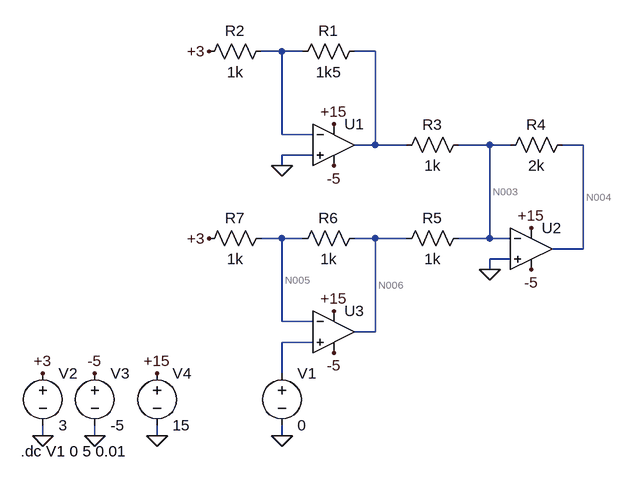
[diagram p0: schematic Draft2.asc]
Draft2.asc, the LTspice schematic file:
Version 4
SHEET 1 880 680
WIRE 80 -144 48 -144
WIRE 112 -144 80 -144
WIRE 224 -144 192 -144
WIRE 80 -16 80 -144
WIRE 128 -16 80 -16
WIRE 224 0 224 -144
WIRE 224 0 192 0
WIRE 272 0 224 0
WIRE 400 0 352 0
WIRE 432 0 400 0
WIRE 544 0 512 0
WIRE 128 16 80 16
WIRE 80 32 80 16
WIRE 80 144 48 144
WIRE 112 144 80 144
WIRE 224 144 192 144
WIRE 272 144 224 144
WIRE 400 144 400 0
WIRE 400 144 352 144
WIRE 432 144 400 144
WIRE 544 160 544 0
WIRE 544 160 496 160
WIRE 432 176 400 176
WIRE 400 192 400 176
WIRE 80 272 80 144
WIRE 128 272 80 272
WIRE 224 288 224 144
WIRE 224 288 192 288
WIRE 128 304 80 304
WIRE 80 352 80 304
WIRE -288 448 -288 432
WIRE -208 448 -208 432
WIRE -112 448 -112 432
WIRE 80 448 80 432
FLAG 160 -32 +15
FLAG 160 32 -5
FLAG 464 128 +15
FLAG 464 192 -5
FLAG 160 256 +15
FLAG 160 320 -5
FLAG -32 -144 +3
FLAG 80 32 0
FLAG 400 192 0
FLAG 80 448 0
FLAG -32 144 +3
FLAG -288 352 +3
FLAG -208 352 -5
FLAG -112 352 +15
FLAG -288 448 0
FLAG -208 448 0
FLAG -112 448 0
SYMBOL OpAmps\\UniversalOpAmp2 160 0 R0
SYMATTR InstName U1
SYMBOL OpAmps\\UniversalOpAmp2 464 160 R0
SYMATTR InstName U2
SYMBOL OpAmps\\UniversalOpAmp2 160 288 R0
SYMATTR InstName U3
SYMBOL res 208 -160 R90
WINDOW 0 0 56 VBottom 2
WINDOW 3 32 56 VTop 2
SYMATTR InstName R1
SYMATTR Value 1k5
SYMBOL res 64 -160 R90
WINDOW 0 0 56 VBottom 2
WINDOW 3 32 56 VTop 2
SYMATTR InstName R2
SYMATTR Value 1k
SYMBOL res 368 -16 R90
WINDOW 0 0 56 VBottom 2
WINDOW 3 32 56 VTop 2
SYMATTR InstName R3
SYMATTR Value 1k
SYMBOL res 528 -16 R90
WINDOW 0 0 56 VBottom 2
WINDOW 3 32 56 VTop 2
SYMATTR InstName R4
SYMATTR Value 2k
SYMBOL res 368 128 R90
WINDOW 0 0 56 VBottom 2
WINDOW 3 32 56 VTop 2
SYMATTR InstName R5
SYMATTR Value 1k
SYMBOL res 208 128 R90
WINDOW 0 0 56 VBottom 2
WINDOW 3 32 56 VTop 2
SYMATTR InstName R6
SYMATTR Value 1k
SYMBOL res 64 128 R90
WINDOW 0 0 56 VBottom 2
WINDOW 3 32 56 VTop 2
SYMATTR InstName R7
SYMATTR Value 1k
SYMBOL voltage 80 336 R0
WINDOW 123 0 0 Left 0
WINDOW 39 0 0 Left 0
SYMATTR InstName V1
SYMATTR Value 0
SYMBOL voltage -288 336 R0
WINDOW 123 0 0 Left 0
WINDOW 39 0 0 Left 0
SYMATTR InstName V2
SYMATTR Value 3
SYMBOL voltage -208 336 R0
WINDOW 123 0 0 Left 0
WINDOW 39 0 0 Left 0
SYMATTR InstName V3
SYMATTR Value -5
SYMBOL voltage -112 336 R0
WINDOW 123 0 0 Left 0
WINDOW 39 0 0 Left 0
SYMATTR InstName V4
SYMATTR Value 15
TEXT -322 472 Left 2 !.dc V1 0 5 0.01

The netlist it stands for:
* Draft2.asc
XU1 0 N001 +15 -5 N002 level2 Avol=1Meg GBW=10Meg Slew=10Meg Ilimit=25m Rail=0 Vos=0 En=0 Enk=0 In=0 Ink=0 Rin=500Meg  ; pins In+ In- V+ V- OUT
XU2 0 N003 +15 -5 N004 level2 Avol=1Meg GBW=10Meg Slew=10Meg Ilimit=25m Rail=0 Vos=0 En=0 Enk=0 In=0 Ink=0 Rin=500Meg  ; pins In+ In- V+ V- OUT
XU3 N007 N005 +15 -5 N006 level2 Avol=1Meg GBW=10Meg Slew=10Meg Ilimit=25m Rail=0 Vos=0 En=0 Enk=0 In=0 Ink=0 Rin=500Meg  ; pins In+ In- V+ V- OUT
R1 N002 N001 1k5
R2 N001 +3 1k
R3 N003 N002 1k
R4 N004 N003 2k
R5 N003 N006 1k
R6 N006 N005 1k
R7 N005 +3 1k
V1 N007 0 0
V2 +3 0 3
V3 -5 0 -5
V4 +15 0 15
.dc V1 0 5 0.01
.lib UniversalOpAmp2.lib
.backanno
.end

* Results of the author's LTspice run, read from the files saved beside the schematic
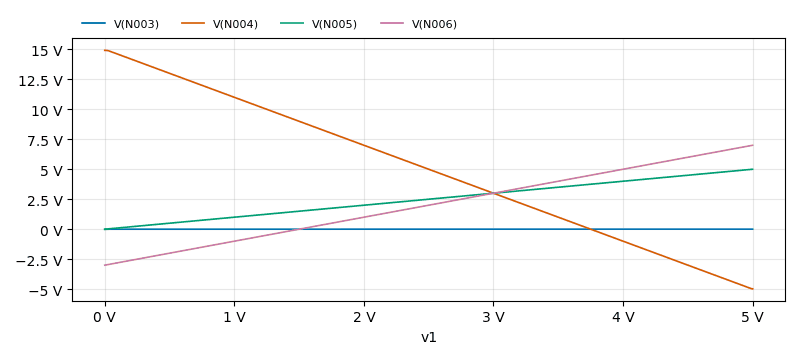
[diagram p1: DC transfer characteristic of Draft2.asc, plotted from the saved traces]
* DC transfer characteristic, 1 run:
*   V(N003): -17.1 mV at v1=0 V, 5.982 mV at v1=5 V, min -17.1 mV, max 5.982 mV
*   V(N004): 14.91 V at v1=0 V, -4.97 V at v1=5 V, min -4.97 V, max 14.91 V
*   V(N005): 8.099 µV at v1=0 V, 5 V at v1=5 V, min 8.099 µV, max 5 V
*   V(N006): -3 V at v1=0 V, 7 V at v1=5 V, min -3 V, max 7 V